# Altium schematic sheet Sheet2.SchDoc
size A4; SheetNumber: 1; SheetTotal: 1
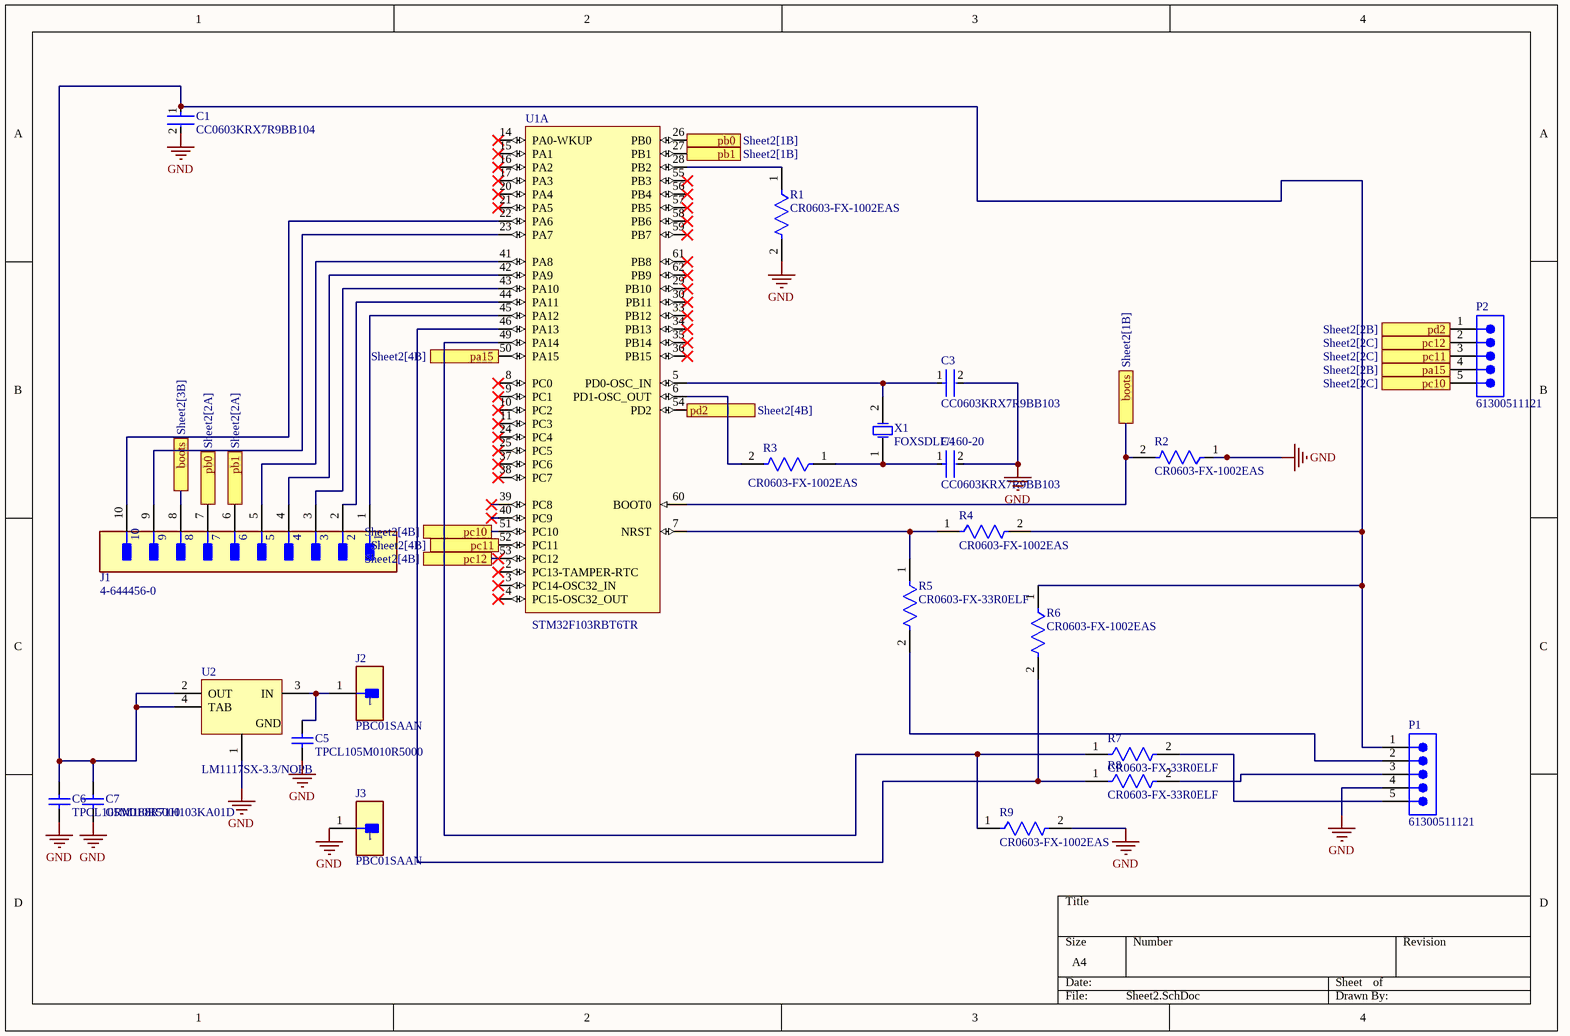
[diagram p0: Sheet2.SchDoc]

## Parts
C1  CC0603KRX7R9BB104  [FP-CC0603-DA-MFG]
C3  CC0603KRX7R9BB103  [FP-CC0603-DA-MFG]
C4  CC0603KRX7R9BB103  [FP-CC0603-DA-MFG]
C5  TPCL105M010R5000  [CAPC1609X100X15LL20]
C6  TPCL105M010R5000  [CAPC1609X100X15LL20]
C7  GRM188R71H103KA01D  [CAPC1608X90X35ML10T15]
J1  4-644456-0  [FP-4-644456-0-MFG]
J2  PBC01SAAN  [FP-PBC01SAAN-MFG]
J3  PBC01SAAN  [FP-PBC01SAAN-MFG]
P1  61300511121  [61300511121]
P2  61300511121  [61300511121]
R1  CR0603-FX-1002EAS  [FP-CR0603-AS-MFG]
R2  CR0603-FX-1002EAS  [FP-CR0603-AS-MFG]
R3  CR0603-FX-1002EAS  [FP-CR0603-AS-MFG]
R4  CR0603-FX-1002EAS  [FP-CR0603-AS-MFG]
R5  CR0603-FX-33R0ELF  [FP-CR0603-IPC_B]
R6  CR0603-FX-1002EAS  [FP-CR0603-AS-MFG]
R7  CR0603-FX-33R0ELF  [FP-CR0603-IPC_B]
R8  CR0603-FX-33R0ELF  [FP-CR0603-IPC_B]
R9  CR0603-FX-1002EAS  [FP-CR0603-AS-MFG]
U1  STM32F103RBT6TR  [STM-LQFP64_V]  (part A of 2)
U2  LM1117SX-3.3/NOPB  [KTT0003B_N]
X1  FOXSDLF/160-20  [FOX-FOXSDLF160-20_V]

## Ports
boots (see Sheet2[1B]), boots (see Sheet2[3B]), pa15 (see Sheet2[2B]), pa15 (see Sheet2[4B]), pb0 (see Sheet2[1B]), pb0 (see Sheet2[2A]), pb1 (see Sheet2[1B]), pb1 (see Sheet2[2A]), pc10 (see Sheet2[2C]), pc10 (see Sheet2[4B]), pc11 (see Sheet2[2C]), pc11 (see Sheet2[4B]), pc12 (see Sheet2[2C]), pc12 (see Sheet2[4B]), pd2 (see Sheet2[2B]), pd2 (see Sheet2[4B])

## Nets
GND: C1.2 C3.2 C4.2 C5.1 C6.1 C7.1 J3.1 P1.4 R1.2 R2.1 R9.2 U2.1(GND)
boots: J1.8 R2.2 U1.60(BOOT0) ; port boots
pa15: P2.4 U1.50(PA15) ; port pa15
pb0: J1.7 U1.26(PB0) ; port pb0
pb1: J1.6 U1.27(PB1) ; port pb1
pc10: P2.5 U1.51(PC10) ; port pc10
pc11: P2.3 U1.52(PC11) ; port pc11
pc12: P2.2 U1.53(PC12) ; port pc12
pd2: P2.1 U1.54(PD2) ; port pd2
NetC1_1: C1.1 C6.2 C7.2 P1.1 R4.2 R6.1 U2.2(OUT) U2.4(TAB)
NetC3_1: C3.1 U1.5(PD0-OSC_IN) X1.2(X2)
NetC4_1: C4.1 R3.1 X1.1(X1)
NetC5_2: C5.2 J2.1 U2.3(IN)
NetJ1_1: J1.1 U1.45(PA12)
NetJ1_2: J1.2 U1.44(PA11)
NetJ1_3: J1.3 U1.43(PA10)
NetJ1_4: J1.4 U1.42(PA9)
NetJ1_5: J1.5 U1.41(PA8)
NetJ1_9: J1.9 U1.23(PA7)
NetJ1_10: J1.10 U1.22(PA6)
NetP1_2: P1.2 R5.2
NetP1_3: P1.3 R8.2
NetP1_5: P1.5 R7.2
NetR1_1: R1.1 U1.28(PB2)
NetR3_2: R3.2 U1.6(PD1-OSC_OUT)
NetR4_1: R4.1 R5.1 U1.7(NRST)
NetR6_2: R6.2 R8.1 U1.46(PA13)
NetR7_1: R7.1 R9.1 U1.49(PA14)

Not connected (* = marked no-connect by the designer): U1 2(PC13-TAMPER-RTC)* 3(PC14-OSC32_IN)* 4(PC15-OSC32_OUT)* 8(PC0)* 9(PC1)* 10(PC2)* 11(PC3)* 14(PA0-WKUP)* 15(PA1)* 16(PA2)* 17(PA3)* 20(PA4)* 21(PA5)* 24(PC4)* 25(PC5)* 29(PB10)* 30(PB11)* 33(PB12)* 34(PB13)* 35(PB14)* 36(PB15)* 37(PC6)* 38(PC7)* 39(PC8)* 40(PC9)* 55(PB3)* 56(PB4)* 57(PB5)* 58(PB6)* 59(PB7)* 61(PB8)* 62(PB9)*

## Library data of the parts
C1 = CMP-2100-03601-2: CAP CER 0.1UF 50V X7R 0603; Manufacturer: YAGEO; Material: Ceramic; Capacitance: 100 nF; Temperature Coefficient: 15%; Tolerance: 0.1; Value: 100 nF; Height: 0.9mm; Voltage: 50 V; ComponentLink2Description: Datasheet; Device Class L2: Capacitors; Temperature Range High: +125°C; Category: Cap; Footprint Url: http://www.yageo.com/exep/pages/download/literatures/UPY-C_GEN_24.pdf; ComponentLink2URL: http://www.yageo.com/documents/recent/UPY-GPHC_X7R_6.3V-to-50V_18.pdf; Package: CC0603-DA; Temperature: -55°C to +125°C; Voltage Rating: 50 V; Temperature Characteristic: X7R; Device Class L1: Passive Components; Temperature Range Low: -55°C; Manufacturer Part Number: CC0603KRX7R9BB104; RoHS: TRUE; Automotive: No; Device Class L3: Ceramic Capacitors; Octopart: https://octopart.com/cc0603krx7r9bb104-yageo-42244635; Mouser Description: Multilayer Ceramic Capacitor, CC Series, 0.1 - F, - 10%, X7R, 50 V, 0603 [1608 Metric]; Lead Free: Yes; Digikey Description: CAP CER 0.1UF 50V X7R 0603
C3 C4 = CMP-2100-03600-2: CAP CER 10000PF 50V X7R 0603; Manufacturer: YAGEO; Tolerance: 0.1; Material: Ceramic; Temperature Coefficient: 15%; Value: 10 nF; Mouser Description: Multilayer Ceramic Capacitor, CC Series, 0.01 - F, - 10%, X7R, 50 V, 0603 [1608 Metric]; Digikey Description: CAP CER 10000PF 50V X7R 0603; Height: 0.9mm; Category: Cap; Temperature Characteristic: X7R; Footprint Url: http://www.yageo.com/exep/pages/download/literatures/UPY-C_GEN_24.pdf; Lead Free: Yes; Voltage Rating: 50 V; Manufacturer Part Number: CC0603KRX7R9BB103; Temperature: -55°C to +125°C; Device Class L3: Ceramic Capacitors; ComponentLink2Description: Datasheet; Voltage: 50 V; Package: CC0603-DA; Octopart: https://octopart.com/cc0603krx7r9bb103-yageo-192938; Automotive: No; Temperature Range High: +125°C; Temperature Range Low: -55°C; RoHS: TRUE; Device Class L1: Passive Components; ComponentLink2URL: http://www.yageo.com/documents/recent/UPY-GPHC_X7R_6.3V-to-50V_18.pdf; Device Class L2: Capacitors; Capacitance: 10 nF
C5 C6 = CMP-2006-00208-1: Manufacturer: AVX Interconnect / Elco; Part Number: TPCL105M010R5000
C7 = CMP-2100-03642-1: Chip Capacitor, 10 nF, +/- 10%, 50 V, -55 to 125 degC, 0603 (1608 Metric), RoHS, Tape and Reel; Manufacturer: Murata; Insulation Resistance: 10GR; Dielectric: X7R; Voltage Rating: 50V; Capacitance: 10nF; Material: Ceramic; Package Quantity: 1; Lead Free: LeadFree; Case/Package: 0603; Termination: SMD/SMT; REACH SVHC: Unknown; Manufacturer URL: http://www.murata.com/; Datasheet URL: http://search.murata.co.jp/Ceramy/image/img/A01X/G101/ENG/GRM188R71H103KA01-01.pdf; Mount: SurfaceMount; Datasheet Version: 42401.0; Number of Pins: 2; Length: 1.6mm; Voltage: 50V; Depth: 0.8mm; Tolerance: 10%; Min Operating Temperature: -55degC; Voltage Rating (DC): 50V; Max Operating Temperature: 125degC; Package Description: 2-Pin Surface Mount Device, Body 1.6 x 0.8 mm; RoHSCompliant: True; Case Code (Imperial): 0603; Width: 0.031inch; Case Code (Metric): 1608; Height: 0.8mm; Package Reference: 0603; Packaging: TapeandReel; Thickness: 0.035inch; Dielectric Material: Ceramic
J1 = CMP-03369-000038-1: CONN HEADER VERT 10POS 2.54MM; Manufacturer: TE Connectivity; Current Rating: 5A; Conn Gender: Male; Number Of Contacts: 10; Conn Orientation: Vertical; Voltage Rating: 250V; Number Of Rows: 1; Device Class L3: unset; Octopart: https://octopart.com/4-644456-0-te+connectivity-39514173; Pitch: 2.54mm; Mouser Description: Headers & Wire Housings NARROW FLT HDR 10P Straight Post; ComponentLink2Description: Datasheet; Height: 0.408inch; Package: 4-644456-0; RoHS: TRUE; Temperature Range High: +105°C; Digikey Description: CONN HEADER VERT 10POS 2.54MM; Temperature: -55°C to +105°C; Device Class L2: Headers and Wire Housings; Automotive: No; Lead Free: Yes; Contact Material: Tin; Manufacturer Part Number: 4-644456-0; Temperature Range Low: -55°C; Footprint Url: https://www.te.com/commerce/DocumentDelivery/DDEController?Action=showdoc&DocId=Customer+Drawing%7F644456%7FD2%7Fpdf%7FEnglish%7FENG_CD_644456_D2.pdf%7F4-644456-0; Device Class L1: Connectors; Category: Conn; ComponentLink2URL: https://www.te.com/commerce/DocumentDelivery/DDEController?Action=showdoc&DocId=Data+Sheet%7F82056_MTA%7F0818%7Fpdf%7FEnglish%7FENG_DS_82056_MTA_0818.pdf%7F4-644456-0
J2 J3 = CMP-25680-000032-1: CONN HEADER VERT 1POS; Number of Positions: 1; Connector Type: Male Pin; Gender: Male; Pitch: 2.54mm; Contact Material: Bronze; Mount: Through Hole; Length: 2.54mm; Height: 2.54mm; Lead Free: Lead Free; Number of Rows: 1; Contact Plating: Gold; Number of Contacts: 1; Housing Material: Plastic; Termination: Solder; Package Quantity: 1; Packaging: Bulk; Color: Black; Contact Mating Length: 0.23inch; Housing Color: Black; Width: 2.54mm
P1 P2 = CMP-1502-01068-3: NexarPartId: 32855526; Connector Type: Male Pin; Gender: Male; Contact Resistance: 20mΩ; Pitch: 2.54mm; Operating Supply Voltage: 250V; Current Rating: 3A; Number of Contacts: 5; Lead Free: Lead Free; Color: Black; Packaging: Bulk; Lead Pitch: 2.54mm; Contact Material: Copper; Min Operating Temperature: -40°C; Contact Mating Length: 5.9944mm; Voltage Rating: 250V; Number of Pins: 5; Number of Positions: 5; Height: 8.89mm; Orientation: Vertical; REACH SVHC: Unknown; RoHS: Compliant; Contact Plating: Gold; Max Operating Temperature: 105°C; Mount: Through Hole; Number of Rows: 1; Termination: Solder
R1-R4 R6 R9 = CMP-07231-000018-1: RES 10K OHM 1% 1/10W 0603; Resistance: 10kR; Temperature Coefficient: 100ppm/°C; Max Power Dissipation: 10mW; Max Operating Temperature: 155°C; Number of Terminations: 2; Case Code (Metric): 1608; Composition: Thick Film; Case Code (Imperial): 0603; Min Operating Temperature: -55°C; Case/Package: 0603; Features: Anti-Sulfur; Packaging: Cut Tape; Tolerance: 1%
R5 R7 R8 = CMP-07231-006573-1: Thick Film Chip Resistors 0603 33Ω 0.1W 1% 100ppm/°C; Voltage Rating: 50V; Max Power Dissipation: 100mW; Resistance: 33R; Mount: Surface Mount; Depth: 0.8mm; Height: 0.45mm; Package Quantity: 5000; REACH SVHC: No SVHC; Temperature Coefficient: 100ppm/°C; Resistance Tolerance: 1%; Width: 0.8mm; Packaging: Tape and Reel; Series: CR0603; Tolerance: 1%; Voltage Rating (DC): 50V; Number of Terminations: 2; Length: 1.6mm; Termination: SMD/SMT; Thickness: 457um; Min Operating Temperature: -55°C; Case/Package: 0603; RoHS Compliant: Yes; Max Operating Temperature: 155°C; Military Standard: Not; Power Rating: 100mW; Contact Plating: Tin; Resistor Type: Thick Film; Construction: Rectangular; Radiation Hardening: No; Features: Moisture Resistant; Case Code (Imperial): 0603; Case Code (Metric): 1608
U1 = CMP-0237-00169-4: ARM Cortex-M3 32-bit MCU, 128 KB Flash, 20 KB Internal RAM, 51 I/Os, 64-pin LQFP, -40 to 85 degC, Tape and Reel; Operating Frequency(F) (Processor speed) (MHz): 72; Internal RAM Size (kB): 20; I/Os (High Current): 51; FLASH Size (Prog) (kB): 128; Supply Voltage(Vcc) min (V): 2; A/D Converter: 2x12-bit (16 Channel); ComponentLink3URL: http://www.st.com/st-web-ui/static/active/en/resource/technical/document/datasheet/DM00037051.pdf; ComponentLink2Description: Datasheet; PackageDescription: 64-Pin Low Profile Quad Flat Package, 10 x 10 mm Body, 0.5 mm Pitch; ComponentLink3Description: Package Specification; Mounting Technology: Surface Mount; ComponentLink1Description: Manufacturer URL; DatasheetVersion: Rev. 16; PackageReference: LQFP64; PartNumber: STM32F103RBT6TR; Core: ARM Cortex-M3; ComponentLink2URL: http://www.st.com/st-web-ui/static/active/en/resource/technical/document/datasheet/CD00161566.pdf; ComponentLink1URL: http://www.st.com/web/en/home.html; PackageVersion: Rev. 4, 06/2013; Packing: Tape and Reel
U2 = CMP-0062-00678-5: 800mA Low-Dropout Linear Regulator, 3-pin TO-263, Pb-Free; Manufacturer: Texas Instruments; CompType: LDO IC; PowerWise: N; PackageTopMarking: NSUZXYTTE#*LM1117S*3.3; High-Reliability: Y; PartNumber: LM1117SX-3.3/NOPB; RoHS: Y; ComponentLink1URL: http://www.ti.com/general/docs/lit/getliterature.tsp?genericPartNumber=LM1117&fileType=pdf; PackageDescription: TO-263, Molded, .400 x .390 x .180in, 3 Lead, .1in Pitch, Surface Mount; PackageReference: KTT0003B; Code_JEDEC: MO-169-AA; PinCount: 3; ComponentLink1Description: Datasheet URL
X1 = CMP-1749-00001-1: Resistance Weld SMD Crystal, 16 MHz, +/- 30 ppm, 20 pF, -20 to 70 degC, 2-Pin SMD, RoHS, Tape and Reel; Output Current: 3 mA; Case\Package: SOT-553-6; Min Supply Voltage (DC): 4 V; Max Supply Voltage: 3.3 V; Min Supply Voltage: 1.4 V; Interface: I2C; Max Supply Voltage (DC): 6 V; ComponentLink2Description: Datasheet; REACH SVHC: No SVHC; ComponentLink1URL: http://www.foxonline.com/; ComponentLink2URL: http://foxonline.com/pdfs/hc49sdlf.pdf; Pins: 6; Packaging: Cut Tape; ComponentLink1Description: Manufacturer URL; Weight: 9.9E-05 oz; Length: 1.6 mm; RoHSCompliant: true; Min Operating Temperature: -55 degC; Radiation Hardening: No; PackageDescription: 2-Pin Surface Mount Device, Body 5 x 11.7 mm, Height 4.5 mm; Package Quantity: 1; Width: 1.2 mm; DatasheetVersion: Mar-15; Max Operating Temperature: 150 degC; Mount: Surface Mount; PackageReference: FOX-FOXSDLF160-20; Height: 0.55 mm